# EAGLE design ESP32_Sparrow (EAGLE 9.6.2)
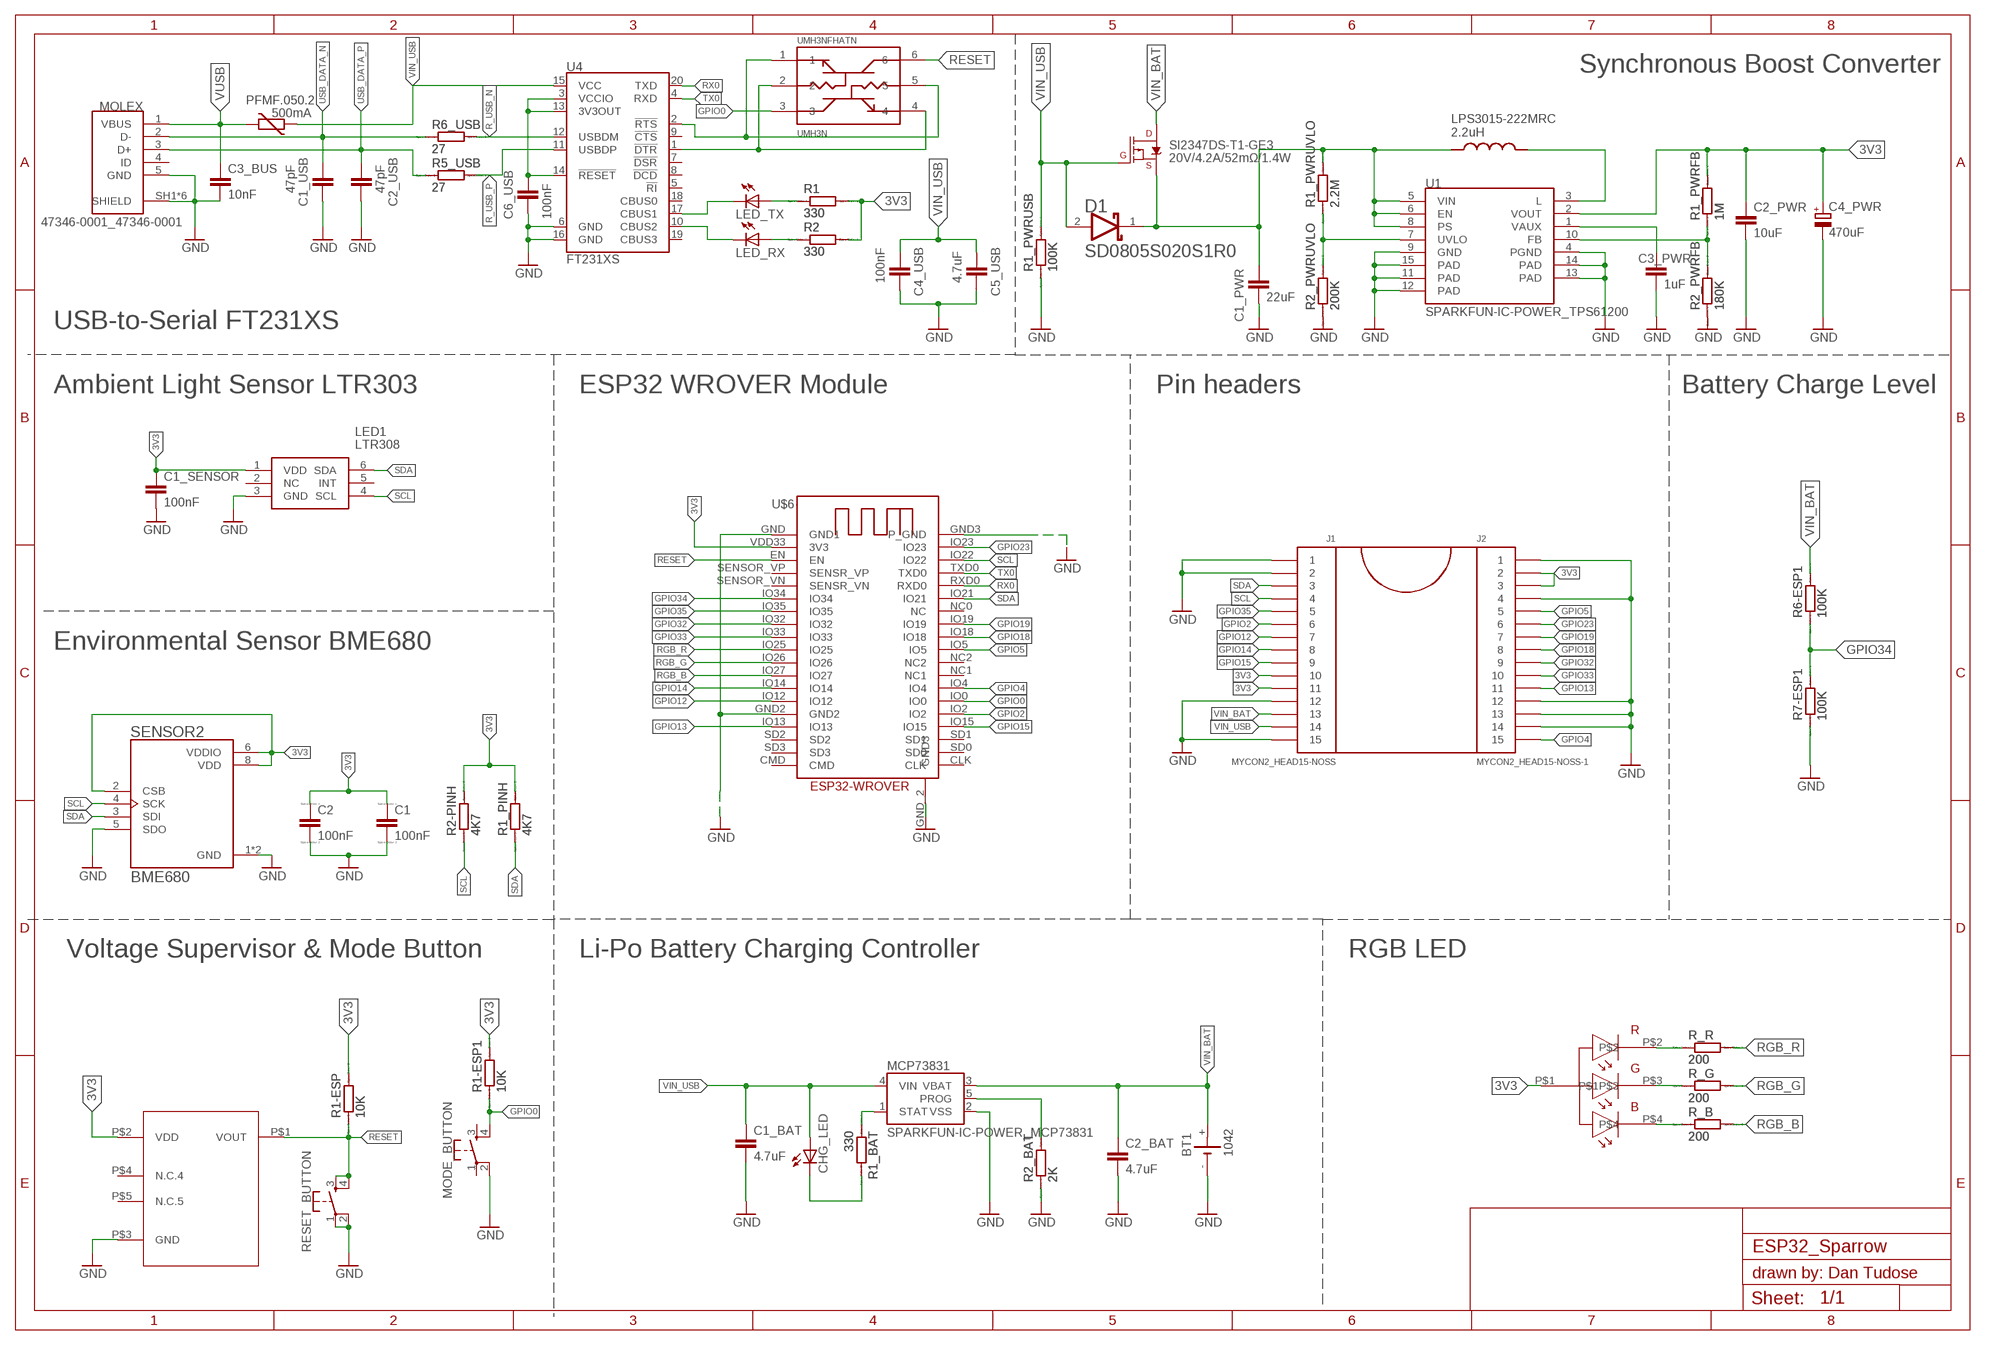
[diagram p0: schematic, sheet 1]

## Parts
BD48E27G-TR  BD48E27G-TR_BD48E27G-TR  [BD48E27G-TR_SSOP5]
BT1  1042  [BAT_1042]
C1  100nF  EAGLE-LTSPICE_CC0402  [EAGLE-LTSPICE_C0402]
C1_BAT  4.7uF  RCL_C-EUC0603  [RCL_C0603]
C1_PWR  22uF  RCL_C-EUC0603  [RCL_C0603]
C1_SENSOR  100nF  RCL_C-EUC0603  [RCL_C0603]
C1_USB  47pF  RCL_C-EUC0603  [RCL_C0603]
C2  100nF  EAGLE-LTSPICE_CC0402  [EAGLE-LTSPICE_C0402]
C2_BAT  4.7uF  RCL_C-EUC0603  [RCL_C0603]
C2_PWR  10uF  RCL_C-EUC0603  [RCL_C0603]
C2_USB  47pF  RCL_C-EUC0603  [RCL_C0603]
C3_BUS  10nF  RCL_C-EUC0603  [RCL_C0603]
C3_PWR  1uF  RCL_C-EUC0603  [RCL_C0603]
C4_PWR  470uF  RCL_CPOL-EUD/7343-31R  [RCL_D/7343-31R]
C4_USB  100nF  RCL_C-EUC0603  [RCL_C0603]
C5_USB  4.7uF  RCL_C-EUC0603  [RCL_C0603]
C6_USB  100nF  RCL_C-EUC0603  [RCL_C0603]
CHG_LED  ADAFRUIT_LEDCHIP-LED0603  [ADAFRUIT_CHIP-LED0603]
D1  AVX---SD0805S020S1R0_AVX_SD0805S020S1R0AVX_SD0805S020S1R0_0_0  [AVX---SD0805S020S1R0_AVX_SD0805S020S1R0_0]
J1  MYCON2_HEAD15-NOSS  [MYCON2_HEAD15-NOSS]
J2  MYCON2_HEAD15-NOSS-1  [MYCON2_HEAD15-NOSS-1]
LED1  LTR308  SAMACSYS_PARTS_LTR-303ALS-01  [SAMACSYS_PARTS_LTR303ALS01]
LED_RX  ADAFRUIT_LEDCHIP-LED0603  [ADAFRUIT_CHIP-LED0603]
LED_TX  ADAFRUIT_LEDCHIP-LED0603  [ADAFRUIT_CHIP-LED0603]
MCP73831  SPARKFUN-IC-POWER_MCP73831  [SPARKFUN-IC-POWER_SOT23-5]
MODE_BUTTON  SPARKFUN-SWITCHES_MOMENTARY-SWITCH-SPST-2-SMD-4.6X2.8MM  [SPARKFUN-SWITCHES_TACTILE_SWITCH_SMD_4.6X2.8MM]
MOLEX  47346-0001_47346-0001  [47346-0001_MOLEX_47346-0001]
PFMF.050.2  500mA  VARISTOR_VARISTORCN1812  [VARISTOR_CT/CN1812]
R1  330  EAGLE-LTSPICE_RR0402  [EAGLE-LTSPICE_R0402]
R1-ESP  10K  EAGLE-LTSPICE_RR0402  [EAGLE-LTSPICE_R0402]
R1-ESP1  10K  EAGLE-LTSPICE_RR0402  [EAGLE-LTSPICE_R0402]
R1_BAT  330  EAGLE-LTSPICE_RR0402  [EAGLE-LTSPICE_R0402]
R1_PINH  4K7  EAGLE-LTSPICE_RR0402  [EAGLE-LTSPICE_R0402]
R1_PWRFB  1M  EAGLE-LTSPICE_RR0402  [EAGLE-LTSPICE_R0402]
R1_PWRUSB  100K  EAGLE-LTSPICE_RR0402  [EAGLE-LTSPICE_R0402]
R1_PWRUVLO  2.2M  EAGLE-LTSPICE_RR0402  [EAGLE-LTSPICE_R0402]
R2  330  EAGLE-LTSPICE_RR0402  [EAGLE-LTSPICE_R0402]
R2-PINH  4K7  EAGLE-LTSPICE_RR0402  [EAGLE-LTSPICE_R0402]
R2_BAT  2K  EAGLE-LTSPICE_RR0402  [EAGLE-LTSPICE_R0402]
R2_PWRFB  180K  EAGLE-LTSPICE_RR0402  [EAGLE-LTSPICE_R0402]
R2_PWRUVLO  200K  EAGLE-LTSPICE_RR0402  [EAGLE-LTSPICE_R0402]
R5_USB  27  EAGLE-LTSPICE_RR0402  [EAGLE-LTSPICE_R0402]
R6-ESP1  100K  EAGLE-LTSPICE_RR0402  [EAGLE-LTSPICE_R0402]
R6_USB  27  EAGLE-LTSPICE_RR0402  [EAGLE-LTSPICE_R0402]
R7-ESP1  100K  EAGLE-LTSPICE_RR0402  [EAGLE-LTSPICE_R0402]
R_B  200  EAGLE-LTSPICE_RR0402  [EAGLE-LTSPICE_R0402]
R_G  200  EAGLE-LTSPICE_RR0402  [EAGLE-LTSPICE_R0402]
R_R  200  EAGLE-LTSPICE_RR0402  [EAGLE-LTSPICE_R0402]
RESET_BUTTON  SPARKFUN-SWITCHES_MOMENTARY-SWITCH-SPST-2-SMD-4.6X2.8MM  [SPARKFUN-SWITCHES_TACTILE_SWITCH_SMD_4.6X2.8MM]
SENSOR2  BME680  BME680_BME680  [BME680_PSON80P300X300X100-8N]
SI2347DS-T1-GE3  20V/4.2A/52mΩ/1.4W  SPARKFUN-DISCRETESEMI_MOSFET_PCH-DMG2305UX-7  [SPARKFUN-DISCRETESEMI_SOT23-3]
U1  SPARKFUN-IC-POWER_TPS61200  [SPARKFUN-IC-POWER_QFN-10_PAD]
U4  FT231XS  SPARKFUN-IC-COMMS_FT231XS  [SPARKFUN-IC-COMMS_SSOP20_L]
U$2  150202M153130_150202M153130-RGB  [150202M153130_150202M153130]
U$5  LPS3015_LPS3015  [LPS3015_LPS3015-222MRC]
U$6  ESP32-WROVER_ESP32-WROVER  [ESP32-WROVER_ESP32-WROVER]
UMH3NFHATN  UMH3N_UMH3N  [UMH3N_SOP65P210X100-6N]

## Nets
3V3: BD48E27G-TR.P$2(VDD) C1.1 C1_SENSOR.1 C2.1 C2_PWR.1 C4_PWR.+ J1.10 J1.11 J2.2 J2.3 LED1.1(VDD) R1-ESP1.2 R1-ESP.2 R1.2 R1_PINH.2 R1_PWRFB.2 R2-PINH.2 R2.2 SENSOR2.2(CSB) SENSOR2.6(VDDIO) SENSOR2.8(VDD) U1.2(VOUT) U$2.P$1 U$6.VDD33(3V3)
GND: BD48E27G-TR.P$3(GND) BT1.- C1.2 C1_BAT.2 C1_PWR.2 C1_SENSOR.2 C1_USB.2 C2.2 C2_BAT.2 C2_PWR.2 C2_USB.2 C3_BUS.2 C3_PWR.2 C4_PWR.- C4_USB.2 C5_USB.2 C6_USB.2 J1.1 J1.2 J1.12 J1.15 J2.1 J2.4 J2.12 J2.13 J2.14 LED1.3(GND) MCP73831.2(VSS) MODE_BUTTON.2 MOLEX.5(GND) MOLEX.SH1(SHIELD) MOLEX.SH2(SHIELD) MOLEX.SH3(SHIELD) MOLEX.SH4(SHIELD) MOLEX.SH5(SHIELD) MOLEX.SH6(SHIELD) R1_PWRUSB.1 R2_BAT.1 R2_PWRFB.1 R2_PWRUVLO.1 R7-ESP1.1 RESET_BUTTON.1 RESET_BUTTON.2 SENSOR2.1(GND) SENSOR2.5(SDO) SENSOR2.7(GND) U1.4(PGND) U1.9(GND) U1.11(PAD) U1.12(PAD) U1.13(PAD) U1.14(PAD) U1.15(PAD) U4.6(GND) U4.16(GND) U$6.GND2 U$6.GND3(P_GND) U$6.GND(GND1) U$6.GND_2(GND3)
GPIO0: MODE_BUTTON.4 R1-ESP1.1 U$6.IO0 UMH3NFHATN.3
GPIO2: J1.6 U$6.IO2
GPIO4: J2.15 U$6.IO4
GPIO5: J2.5 U$6.IO5
GPIO12: J1.7 U$6.IO12
GPIO13: J2.11 U$6.IO13
GPIO14: J1.8 U$6.IO14
GPIO15: J1.9 U$6.IO15
GPIO18: J2.8 U$6.IO18
GPIO19: J2.7 U$6.IO19
GPIO23: J2.6 U$6.IO23
GPIO32: J2.9 U$6.IO32
GPIO33: J2.10 U$6.IO33
GPIO34: R6-ESP1.1 R7-ESP1.2 U$6.IO34
GPIO35: J1.5 U$6.IO35
N$1: R1_PWRUVLO.1 R2_PWRUVLO.2 U1.7(UVLO)
N$5: MCP73831.1(STAT) R1_BAT.1
N$6: CHG_LED.C R1_BAT.2
N$7: MCP73831.5(PROG) R2_BAT.2
N$8: R_R.1 U$2.P$2
N$9: U1.3(L) U$5.P$2
N$10: R_G.1 U$2.P$3
N$11: R_B.1 U$2.P$4
N$12: R1_PWRFB.1 R2_PWRFB.2 U1.10(FB)
N$13: C3_PWR.1 U1.1(VAUX)
N$15: C6_USB.1 U4.3(VCCIO) U4.13(3V3OUT) U4.14(!RESET)
N$17: LED_TX.A R1.1
N$18: LED_RX.A R2.1
N$20: U4.1(!DTR) UMH3NFHATN.2 UMH3NFHATN.4
N$21: LED_TX.C U4.17(CBUS1)
N$23: LED_RX.C U4.10(CBUS2)
N$24: U4.2(!RTS) UMH3NFHATN.1 UMH3NFHATN.5
R_USB_N: R6_USB.2 U4.12(USBDM)
R_USB_P: R5_USB.2 U4.11(USBDP)
RESET: BD48E27G-TR.P$1(VOUT) R1-ESP.1 RESET_BUTTON.3 RESET_BUTTON.4 U$6.EN UMH3NFHATN.6
RGB_B: R_B.2 U$6.IO27
RGB_G: R_G.2 U$6.IO26
RGB_R: R_R.2 U$6.IO25
RX0: U4.20(TXD) U$6.RXD0
SCL: J1.4 LED1.4(SCL) R2-PINH.1 SENSOR2.4(SCK) U$6.IO22
SDA: J1.3 LED1.6(SDA) R1_PINH.1 SENSOR2.3(SDI) U$6.IO21
TX0: U4.4(RXD) U$6.TXD0
USB_DATA_N [RES_DIFF]: C1_USB.1 MOLEX.2(D-) R6_USB.1
USB_DATA_P [RES_DIFF]: C2_USB.1 MOLEX.3(D+) R5_USB.1
VIN: C1_PWR.1 D1.1(CATHODE) R1_PWRUVLO.2 SI2347DS-T1-GE3.2(S) U1.5(VIN) U1.6(EN) U1.8(PS) U$5.P$1
VIN_BAT: BT1.+ C2_BAT.1 J1.13 MCP73831.3(VBAT) R6-ESP1.2 SI2347DS-T1-GE3.3(D)
VIN_USB: C1_BAT.1 C4_USB.1 C5_USB.1 CHG_LED.A D1.2(ANODE) J1.14 MCP73831.4(VIN) PFMF.050.2.1 R1_PWRUSB.2 SI2347DS-T1-GE3.1(G) U4.15(VCC)
VUSB: C3_BUS.1 MOLEX.1(VBUS) PFMF.050.2.2
Unconnected: BD48E27G-TR.P$4(N.C.4) BD48E27G-TR.P$5(N.C.5) LED1.2(NC) LED1.5(INT) MODE_BUTTON.1 MODE_BUTTON.3 MOLEX.4(ID) U4.5(!RI) U4.7(!DSR) U4.8(!DCD) U4.9(!CTS) U4.18(CBUS0) U4.19(CBUS3) U$6.CLK U$6.CMD U$6.NC0(NC) U$6.NC1 U$6.NC2 U$6.SD0 U$6.SD1 U$6.SD2 U$6.SD3 U$6.SENSOR_VN(SENSR_VN) U$6.SENSOR_VP(SENSR_VP)

## Notes on the sheet
- Synchronous Boost Converter
- USB-to-Serial FT231XS
- Ambient Light Sensor LTR303 | ESP32 WROVER Module | Pin headers | Battery Charge Level
- Environmental Sensor BME680
- Voltage Supervisor & Mode Button | Li-Po Battery Charging Controller | RGB LED
- drawn by: Dan Tudose

## Library data of the parts
BD48E27G-TR = ESP32_WROVER:BD48E27G-TR_BD48E27G-TR
BT1 = 1042:1042: Lithium-Ion Battery Holder, 1 Cell, Plastic UL 94V-O, SMT Check availability <https://pricing.snapeda.com/parts/1042/Keystone%20Electronics%20Corp./view-part?ref=eda>; AVAILABILITY: In Stock; DESCRIPTION: SMT Holder for 18650 Battery; MF: Keystone Electronics Corp.; MP: 1042; PACKAGE: None; PRICE: None; PURCHASE-URL: https://pricing.snapeda.com/search/part/1042/?ref=eda
C1 C2 = ESP32_WROVER:EAGLE-LTSPICE_C: CAPACITOR, European symbol; SPICEMODEL: NONE; SPICEPREFIX: C
C1_BAT C1_PWR C1_SENSOR C1_USB C2_BAT C2_PWR C2_USB C3_BUS C3_PWR C4_USB C5_USB C6_USB = ESP32_WROVER:RCL_C-EU: CAPACITOR, European symbol; SPICEPREFIX: C
C4_PWR = ESP32_WROVER:RCL_CPOL-EU: POLARIZED CAPACITOR, European symbol; SPICEPREFIX: C
CHG_LED LED_RX LED_TX = ESP32_WROVER:ADAFRUIT_LED: LED OSRAM: - CHIPLED LG R971, LG N971, LY N971, LG Q971, LY Q971, LO R971, LY R971 LH N974, LH R974 LS Q976, LO Q976, LY Q976 LO Q996 - Hyper CHIPLED LW Q18S LB Q993, LB Q99A, LB R99A - SideLED LS A670, LO A670, LY A670, LG A670, LP A670 LB A673, LV A673, LT A673, LW A673 LH A674 LY A675 LS A676, LA A676, LO A676, LY A676, LW A676 LS A679, LY A679, LG A679 - Hyper Micro SIDELED® LS Y876, LA Y876, LO Y876, LY Y876 LT Y87S - SmartLED LW L88C, LW L88S LB L89C, LB L89S, LG L890 LS L89K, LO L89K, LY L89K LS L896, LA L896, LO L896, LY L896 - TOPLED LS T670, LO T670, LY T670, LG T670, LP T670 LSG T670, LSP T670, LSY T670, LOP T670, LYG T670 LG T671, LOG T671, LSG T671 LB T673, LV T673, LT T673, LW T673 LH T674 LS T676, LA T676, LO T676, LY T676, LB T676, LH T676, LSB T676, LW T676 LB T67C, LV T67C, LT T67C, LS T67K, LO T67K, LY T67K, LW E67C LS E67B, LA E67B, LO E67B, LY E67B, LB E67C, LV E67C, LT E67C LW T67C LS T679, LY T679, LG T679 LS T770, LO T770, LY T770, LG T770, LP T770 LB T773, LV T773, LT T773, LW T773 LH T774 LS E675, LA E675, LY E675, LS T675 LS T776, LA T776, LO T776, LY T776, LB T776 LHGB T686 LT T68C, LB T68C - Hyper Mini TOPLED® LB M676 - Mini TOPLED Santana® LG M470 LS M47K, LO M47K, LY M47K Source: http://www.osram.convergy.de/
D1 = ESP32_WROVER:AVX---SD0805S020S1R0_AVX_SD0805S020S1R0: Schottky Barrier Rectifier Diode; CENTROID_NOT_SPECIFIED: No; DATASHEET: http://datasheets.avx.com/schottky.pdf; DIGIKEY_DESCRIPTION: DIODE SCHOTTKY 20V 1A 0805; DIGIKEY_PART_NUMBER: 478-7800-1-ND; LEAD_FREE: yes; MF: AVX; MOUSER_PART_NUMBER: 581-SD0805S020S1R0; MPN: SD0805S020S1R0; PACKAGE: 0805 (2012 metric); PREFIX: D; ROHS: yes; TEMPERATURE_RANGE_HIGH: +125°C; TEMPERATURE_RANGE_LOW: -55°C
J1 = ESP32_WROVER:MYCON2_HEAD15-NOSS
J2 = ESP32_WROVER:MYCON2_HEAD15-NOSS-1
LED1 = ESP32_WROVER:SAMACSYS_PARTS_LTR-303ALS-01: Ambient Light Sensors Ambient Light Photo Sensor Source: Datasheet <http://optoelectronics.liteon.com/upload/download/DS86-2013-0004/LTR-303ALS-01_DS_V1.pdf>; ARROW_PART_NUMBER: LTR-303ALS-01; ARROW_PRICE-STOCK: https://www.arrow.com/en/products/ltr-303als-01/lite-on-technology?region=nac; DESCRIPTION: Ambient Light Sensors Ambient Light Photo Sensor; HEIGHT: 0mm; MANUFACTURER_NAME: Lite-On; MANUFACTURER_PART_NUMBER: LTR-303ALS-01; MOUSER_PART_NUMBER: 859-LTR-303ALS-01; MOUSER_PRICE-STOCK: https://www.mouser.co.uk/ProductDetail/Lite-On/LTR-303ALS-01?qs=Ml%2FaxAEbwm%252Bm%252BetMkBDC8g%3D%3D
MCP73831 = ESP32_WROVER:SPARKFUN-IC-POWER_MCP73831: MCP73831T Li-Ion, Li-Pol Controller Miniature single cell, fully integrated Li-Ion, Li-polymer charge management controller Datasheet <http://ww1.microchip.com/downloads/en/DeviceDoc/20001984g.pdf> SparkFun Products: SparkFun ESP32 Thing <https://www.sparkfun.com/products/13907> SparkFun 9DoF Razor IMU M0 <https://www.sparkfun.com/products/14001>; PROD_ID: IC-09995
MODE_BUTTON RESET_BUTTON = ESP32_WROVER:SPARKFUN-SWITCHES_MOMENTARY-SWITCH-SPST-2: Momentary Switch (Pushbutton) - SPST - Two Circuits Normally-open (NO) SPST momentary switches (buttons, pushbuttons). Schematic symbol includes two switch circuits. Variants SMD-4.6MMX2.8MM - 4.60mm x 2.80mm Tactile Momentary Button Switch - Used on SparkFun SAMD21 Mini Breakout <https://www.sparkfun.com/products/13664> SMD-5.2MM - Mini Pushbutton Switch - SMD <https://www.sparkfun.com/products/8720> - Used on Arduino Pro Mini <https://www.sparkfun.com/products/11114>; PROD_ID: SWCH-14139; SF_SKU: COM-08720
MOLEX = ESP32_WROVER:47346-0001_47346-0001: CONN RCPT 5POS MICRO USB R/A SMD Check prices <https://pricing.snapeda.com/parts/47346-0001/Molex/view-part?ref=eda>; AVAILABILITY: Warning; DESCRIPTION: USB - micro B USB 2.0 Receptacle Connector 5 Position Surface Mount, Right Angle; MF: Molex; MP: 47346-0001; PACKAGE: None; PRICE: None
PFMF.050.2 = ESP32_WROVER:VARISTOR_VARISTOR: VARISTOR
R1 R1-ESP R1_BAT R1_PINH R1_PWRUSB R1_PWRUVLO R2 R2-PINH R2_PWRUVLO R5_USB R6-ESP1 R6_USB R7-ESP1 R_B R_G R_R = ESP32_WROVER:EAGLE-LTSPICE_R*?: RESISTOR, European symbol; SPICEMODEL: NONE; SPICEPREFIX: R
R1-ESP1 R1_PWRFB R2_BAT R2_PWRFB = ESP32_WROVER:EAGLE-LTSPICE_R: RESISTOR, European symbol; SPICEMODEL: NONE; SPICEPREFIX: R
SENSOR2 = ESP32_WROVER:BME680_BME680: Integrated Environmental Unit; AVAILABILITY: Unavailable; DESCRIPTION: Integrated Environmental Unit; MF: Bosch Sensortec; MP: BME680; PACKAGE: LGA-8 Bosch Tools; PRICE: None
SI2347DS-T1-GE3 = ESP32_WROVER:SPARKFUN-DISCRETESEMI_MOSFET_PCH: P-channel MOSFETs Voltage controlled devices that allow control of high current outputs. SparkFun Products: SparkFun ESP32 Thing <https://www.sparkfun.com/products/13907> SparkFun ESP8266 Thing <https://www.sparkfun.com/products/13231> SparkFun Pi Servo HAT V2 <https://www.sparkfun.com/products/15316> DMG2305UX-7 (20V/4.2A/SOT23-3); PROD_ID: TRAN-14388
U1 = ESP32_WROVER:SPARKFUN-IC-POWER_TPS61200: DC to DC Booster IC-10035; PROD_ID: IC-10035
U4 = ESP32_WROVER:SPARKFUN-IC-COMMS_FT231X: FTDI FT231X Full Speed USB to Full-handshake UART This USB2.0 Full Speed IC offers a compact bridge to full handshake UART interfaces. The device is a UART, capable of operating up to 3MBaud, with low power consumption (8mA). The FT231X includes the complete FT-X series feature set and enables USB to be added into a system design quickly and easily over a UART interface. Datasheet <http://cdn.sparkfun.com/datasheets/Components/General%20IC/DS_FT231X.pdf> SparkFun Products SparkFun RedBoard - Programmed with Arduino <https://www.sparkfun.com/products/12757> (DEV-12757) SparkFun XBee Explorer USB <https://www.sparkfun.com/products/11812> (WRL-11812) SparkFun XBee Explorer Dongle <https://www.sparkfun.com/products/11697> (WRL-11697) SparkFun Blynk Board - ESP8266 <https://www.sparkfun.com/products/13794> (WRL-13794) SparkFun ESP8266 Thing - Dev Board <https://www.sparkfun.com/products/13711> (WRL-13711) SparkFun Block for Intel® Edison - Base <https://www.sparkfun.com/products/13045> (DEV-13045) SparkFun RedStick <https://www.sparkfun.com/products/13741> (DEV-13741) SparkFun Beefy 3 - FTDI Basic Breakout <https://www.sparkfun.com/products/13746> (DEV-13746) SparkFun FT231X Breakout <https://www.sparkfun.com/products/11736> (BOB-11736); PROD_ID: IC-11524
U$2 = ESP32_WROVER:150202M153130_150202M153130-RGB
U$5 = ESP32_WROVER:LPS3015_LPS3015
U$6 = ESP32_WROVER:ESP32-WROVER_ESP32-WROVER
UMH3NFHATN = ESP32_WROVER:UMH3N_UMH3N: Dual PNP/NPN transistor for chip reset; AVAILABILITY: Unavailable; DESCRIPTION: Pre-Biased Bipolar Transistor (BJT) 2 NPN - Pre-Biased (Dual) 50V 100mA 250MHz 150mW Surface Mount UMT6; MF: Rohm; MP: UMH3N; PACKAGE: SOT-363 Rohm; PRICE: None

## Board
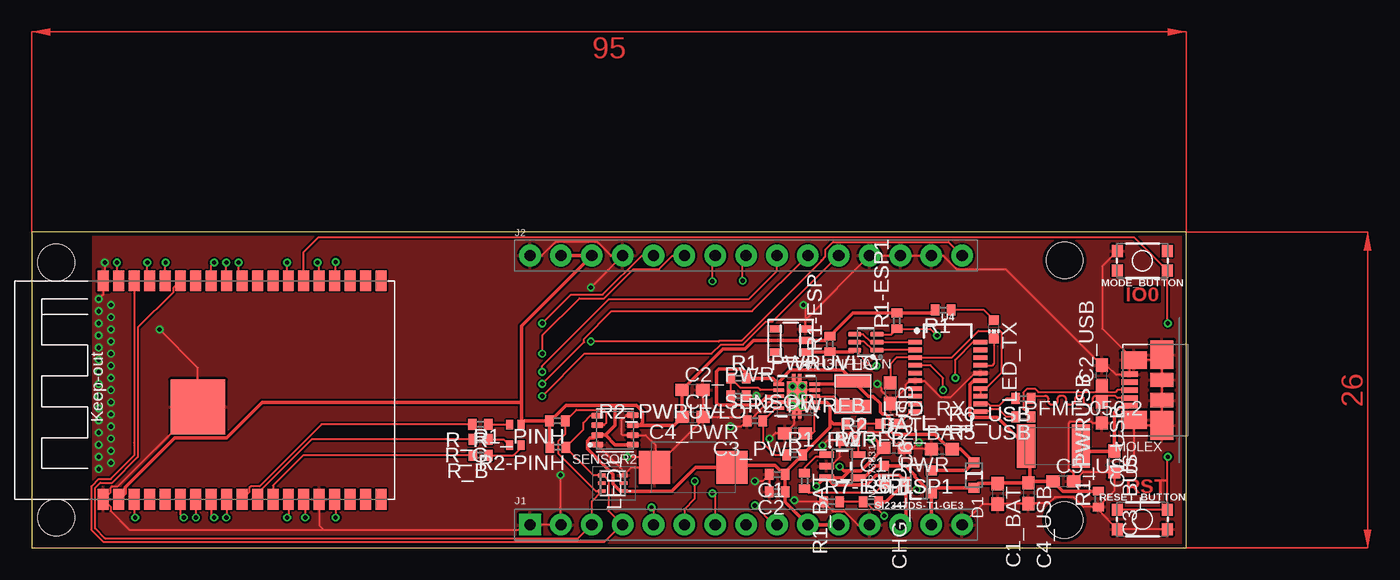
[diagram p1: board, top side]
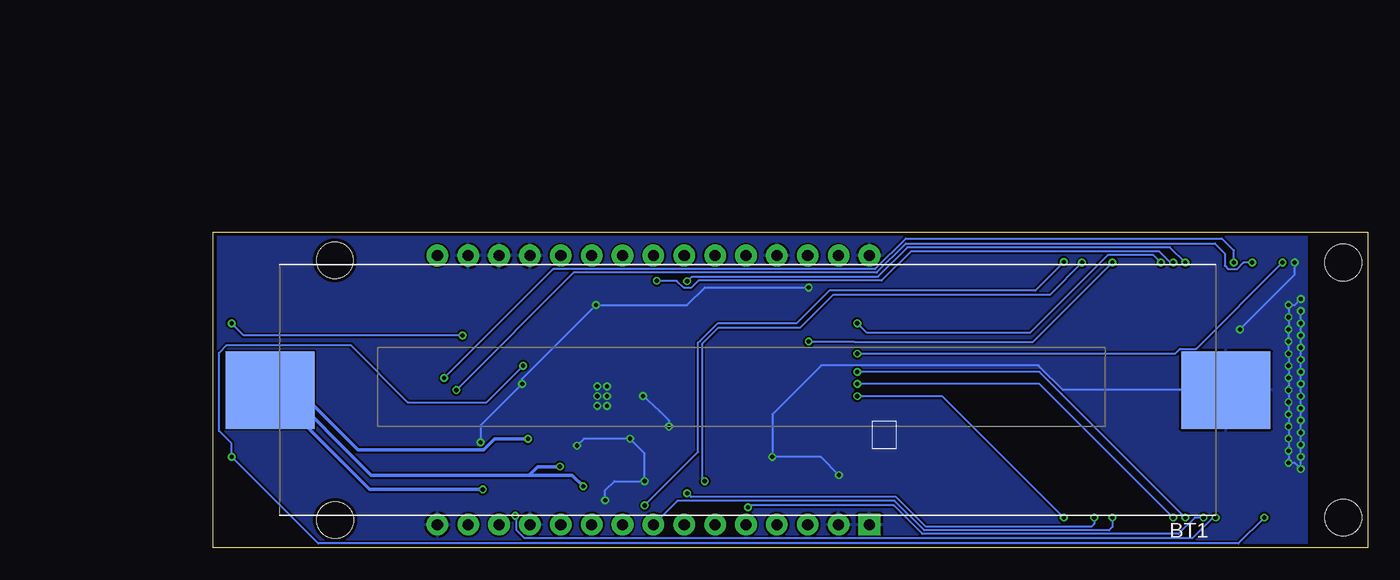
[diagram p2: board, bottom side, seen from below]

Size 95 x 26 mm. Coordinates in mm from the lower left corner, seen from the top.
Outline: 0,0 95,0 95,26 0,26 0,0
Copper layers (1*16): Top 0.035mm / dielectric 1.5mm / Bottom 0.035mm
Design rules "PCB-POOL Standard *": minimum track width 0.15mm, minimum drill 0.3mm, track to track 0.15mm, track to pad 0.15mm, pad to pad 0.15mm, via to via 0.15mm, smd to smd 0.15mm, copper to edge 0.3mm, drill to drill 0.2mm, minimum pad ring 0.2mm, minimum via ring 0.15mm, stop-mask expansion 0.03mm, vias tented up to drill 20mil, thermal gap 0.2mm
Holes 3 mm at 2,2.5 2,23.5 84.97,2.3 85,23.7

### Footprints (pad centres in the part's own frame; a part is rotated, then mirrored left to right if it is on the bottom)
BD48E27G-TR_SSOP5 = smd 0.6 x 1: P$1 -0.95,-0.8; P$2 0,-0.8; P$3 0.95,-0.8; P$4 0.95,1.6; P$5 -0.95,1.6
BAT_1042 = smd 7.35 x 6.35: + 39.33,0; - -39.33,0
EAGLE-LTSPICE_C0402 = smd 0.7 x 0.9: 1 -0.65,0; 2 0.65,0
RCL_C0603 = smd 1.1 x 1: 1 -0.85,0; 2 0.85,0
RCL_D/7343-31R = smd 2.55 x 2.7: + 3.175,0; - -3.175,0
ADAFRUIT_CHIP-LED0603 = smd 0.8 x 0.8: A 0,-0.75; C 0,0.75
AVX---SD0805S020S1R0_AVX_SD0805S020S1R0_0 = smd 0.8 x 0.9: 1 -1.05,0; 2 1.05,0
MYCON2_HEAD15-NOSS = drill 0.914 pad 1.778 square: 1 0,0 | drill 0.914 pad 1.778: 2 2.54,0; 3 5.08,0; 4 7.62,0; 5 10.16,0; 6 12.7,0; 7 15.24,0; 8 17.78,0; 9 20.32,0; 10 22.86,0; 11 25.4,0; 12 27.94,0; 13 30.48,0; 14 33.02,0; 15 35.56,0
MYCON2_HEAD15-NOSS-1 = drill 0.914 pad 1.778: 1 0,0; 2 2.54,0; 3 5.08,0; 4 7.62,0; 5 10.16,0; 6 12.7,0; 7 15.24,0; 8 17.78,0; 9 20.32,0; 10 22.86,0; 11 25.4,0; 12 27.94,0; 13 30.48,0; 14 33.02,0; 15 35.56,0
SAMACSYS_PARTS_LTR303ALS01 = smd 0.3 x 0.65: 1 -0.65,-0.9; 2 0,-0.9; 3 0.65,-0.9; 4 0.65,0.9; 5 0,0.9; 6 -0.65,0.9
SPARKFUN-IC-POWER_SOT23-5 = smd 0.55 x 1.2: 1 -0.95,-1.3; 2 0,-1.3; 3 0.95,-1.3; 4 0.95,1.3; 5 -0.95,1.3
SPARKFUN-SWITCHES_TACTILE_SWITCH_SMD_4.6X2.8MM = smd 0.9 x 1: 1 -2.05,-0.8; 2 2.05,-0.8; 3 2.05,0.8; 4 -2.05,0.8
47346-0001_MOLEX_47346-0001 = smd 0.45 x 1.38: 1 -1.3,2.66; 2 -0.65,2.66; 3 0,2.66; 4 0.65,2.66; 5 1.3,2.66 | smd 1.475 x 2.1: SH1 -2.462,2.3; SH2 2.462,2.3 | smd 2.375 x 1.9: SH3 -2.913,0; SH6 2.913,0 | smd 1.175 x 1.9: SH4 -0.838,0; SH5 0.838,0
VARISTOR_CT/CN1812 = smd 1.5 x 3.6: 1 -2.25,0; 2 2.25,0
EAGLE-LTSPICE_R0402 = smd 0.7 x 0.9: 1 -0.65,0; 2 0.65,0
BME680_PSON80P300X300X100-8N = smd 1.016 x 0.5: 1 1.458,1.2; 2 1.458,0.4; 3 1.458,-0.4; 4 1.458,-1.2; 5 -1.458,-1.22; 6 -1.458,-0.4; 7 -1.458,0.4; 8 -1.458,1.2
SPARKFUN-DISCRETESEMI_SOT23-3 = smd 0.8 x 0.9: 1 -0.95,-1; 2 0.95,-1; 3 0,1.1
SPARKFUN-IC-POWER_QFN-10_PAD = smd 0.297 x 0.85: 1 -1,-1.475; 2 -0.5,-1.475; 3 0,-1.475; 4 0.5,-1.475; 5 1,-1.475; 6 1,1.475; 7 0.5,1.475; 8 0,1.475; 9 -0.5,1.475; 10 -1,1.475 | smd 0.7 x 0.28: 11 -1.5,0.25; 12 -1.5,-0.25; 13 1.5,0.25; 14 1.5,-0.25 | smd 2.4 x 1.65: 15 0,0
SPARKFUN-IC-COMMS_SSOP20_L = smd 0.381 x 1.143: 1 -2.857,-2.68; 2 -2.223,-2.68; 3 -1.587,-2.68; 4 -0.953,-2.68; 5 -0.318,-2.68; 6 0.318,-2.68; 7 0.953,-2.68; 8 1.587,-2.68; 9 2.223,-2.68; 10 2.857,-2.68; 11 2.857,2.68; 12 2.223,2.68; 13 1.587,2.68; 14 0.953,2.68; 15 0.318,2.68; 16 -0.318,2.68; 17 -0.953,2.68; 18 -1.587,2.68; 19 -2.223,2.68; 20 -2.857,2.68
150202M153130_150202M153130 = smd 0.8 x 0.6: P$1 -0.85,0.475; P$2 -0.85,-0.475; P$3 0.85,-0.475; P$4 0.85,0.475
LPS3015_LPS3015-222MRC = smd 1.14 x 3.05: P$1 1.075,-0.025; P$2 -1.075,-0.025
ESP32-WROVER_ESP32-WROVER = smd 1.7 x 0.9: CLK 18,1.27; CMD 0,1.27; EN 0,21.59; GND 0,24.13; GND3 18,24.13; GND_2 0,6.35; IO0 18,7.62; IO2 18,6.35; IO4 18,8.89; IO5 18,12.7; IO12 0,7.62; IO13 0,5.08; IO14 0,8.89; IO15 18,5.08; IO18 18,13.97; IO19 18,15.24; IO21 18,17.78; IO22 18,21.59; IO23 18,22.86; IO25 0,12.7; IO26 0,11.43; IO27 0,10.16; IO32 0,15.24; IO33 0,13.97; IO34 0,17.78; IO35 0,16.51; NC0 18,16.51; NC1 18,10.16; NC2 18,11.43; RXD0 18,19.05; SD0 18,2.54; SD1 18,3.81; SD2 0,3.81; SD3 0,2.54; SENSOR_VN 0,19.05; SENSOR_VP 0,20.32; TXD0 18,20.32; VDD33 0,22.86 | smd 4.5 x 4.5: GND2 7.62,16.34
UMH3N_SOP65P210X100-6N = smd 1.09 x 0.4: 1 -0.92,0.65; 2 -0.92,0; 3 -0.92,-0.65; 4 0.92,-0.65; 5 0.92,0; 6 0.92,0.65

### Placement (x,y rotation side)
BD48E27G-TR  62.85,17.08 90 top
BT1  51,13 180 bottom
C1  61.34,6.04 180 top
C1_BAT  79.49,4.46 270 top
C1_PWR  74.88,8.14 180 top
C1_SENSOR  54.38,10.78 0 top
C1_USB  88.05,11.15 270 top
C2  61.34,4.63 180 top
C2_BAT  70.97,8.24 0 top
C2_PWR  54.35,13.02 0 top
C2_USB  88.05,14.2 90 top
C3_BUS  89.09,7.12 270 top
C3_PWR  62.81,9.44 180 top
C4_PWR  54.43,6.63 0 top
C4_USB  82.02,4.51 270 top
C5_USB  84.9,5.49 0 top
C6_USB  70.64,12.74 270 top
CHG_LED  70.12,6.01 180 top
D1  77.53,6 270 top
J1  41,1.92 0 top
J2  41,24.08 0 top
LED1  47.8,5.33 90 top
LED_RX  70.59,10.22 270 top
LED_TX  79.18,18.01 180 top
MCP73831  66.7,6.73 270 top
MODE_BUTTON  91.4,23.65 180 top
MOLEX  93,13 90 top
PFMF.050.2  84.08,8.38 0 top
R1  75.01,19.58 180 top
R1-ESP  65.68,16.8 90 top
R1-ESP1  71.19,18.7 90 top
R1_BAT  63.59,5.52 270 top
R1_PINH  43.25,10.47 180 top
R1_PWRFB  62.79,7.68 0 top
R1_PWRUSB  87.77,4.02 90 top
R1_PWRUVLO  58.16,13.98 0 top
R2  67.63,10.23 180 top
R2-PINH  43.27,8.29 180 top
R2_BAT  67.17,8.85 0 top
R2_PWRFB  59.51,10.48 0 top
R2_PWRUVLO  58.16,12.52 180 top
R5_USB  81.6,10.8 180 top
R6-ESP1  69.06,3.81 0 top
R6_USB  81.6,12.3 180 top
R7-ESP1  65.82,3.81 0 top
R_B  36.93,7.63 180 top
R_G  36.92,8.93 180 top
R_R  36.9,10.18 180 top
RESET_BUTTON  91.4,2.35 0 top
SENSOR2  47.99,9.7 180 top
SI2347DS-T1-GE3  73.02,5.45 90 top
U1  62.95,12.5 90 top
U4  75.38,14.09 270 top
U$2  39.78,9.31 270 top
U$5  67.55,12.7 90 top
U$6  30,4 90 top
UMH3NFHATN  68.64,16.95 180 top

### Tracks (layer width: path | path; a pad name or v marks a point on that pad's centre or on a via)
3V3
  Top 0.3: J1.11 J1.10 | U1.2 65.43,12 65.7,11.72 65.7,10.5 | R1_PWRFB.2 65.7,9.94 65.7,10.5 | R2.2 65.97,10.23 65.7,10.5
  Top 0.305: J2.2 J2.3 40.3,18.3 40.3,12 | R1.2 74.13,19.35 R1-ESP1.2 67.58,19.35 R1-ESP.2 65.31,17.08 BD48E27G-TR.P$2 59.4,17.08 58.7,16.38 56.86,16.38 C2_PWR.1 53.5,10.81 C1_SENSOR.1 52.85,10.1 50,10.1 | R1_PWRFB.2 61.99,6.23 C1.1 | C1.1 61.91,6.04 61.16,6.8 57.77,6.8 C4_PWR.+ 54.6,6.63 52.66,4.68 LED1.1 48.45,4.68 47.83,5.3 47.83,6.05 45.72,8.16 45.72,8.84 45.94,9.05 46.28,9.05 SENSOR2.2 47.2,9.3 | C1.1 C2.1 61.99,3.79 J1.10 | SENSOR2.8 48,8.5 47.2,9.3 | R1_PINH.2 42.6,8.31 R2-PINH.2 | R1_PINH.2 42.67,10.47 43.95,11.75 48,11.75 | 48,11.75 49.77,11.75 50.26,11.26 50.26,10.36 50,10.1 | R1_PINH.2 40.56,10.47 40.3,10.2 | 40.3,10.2 U$2.P$1 | U$6.VDD33 7.66,4.52 7.66,4.97 11.75,9.07 16.04,9.07 18.97,12 40.3,12 | 40.3,12 40.3,10.2 | 50,10.1 SENSOR2.6 | 48,11.75 48,10.1 47.2,9.3
GND  (via drill 0.35)
  Top 0.15: U1.11 62.7,10.18 62.01,9.49 C3_PWR.2 | 63.2,11.3 62.5,12 U1.9 | MCP73831.2 65.73,6.73 66.52,7.52 R2_BAT.1 | R7-ESP1.1 65.95,3.03 66.86,3.03 67.97,1.92 J1.12 | C1_PWR.2 72.44,8.14 71.92,8.14 C2_BAT.2 | J1.15 78.25,3.61 C1_BAT.2 79.54,3.66 C4_USB.2 83.68,3.66 84.19,4.17 85.75,4.17 86.55,3.37 R1_PWRUSB.1 | C5_USB.2 86.53,6.27 C3_BUS.2 89.09,6 89.09,4.69 R1_PWRUSB.1 | R1_PWRUSB.1 87.77,3.13 RESET_BUTTON.1 RESET_BUTTON.2 | 91.15,10.09 MOLEX.SH3 MOLEX.SH4 MOLEX.SH5 MOLEX.SH6 92.55,15.46 MOLEX.SH2 90.34,15.1 MOLEX.5 89.2,14.3 88.45,15.05 C2_USB.2 | 63.24,3.81 62.86,3.81 v62.75,3.92
  Top 0.152: 91.15,10.09 MOLEX.SH1 90.7,7.61 89.09,6 | C2.2 C1.2 60.14,5.5 v59.5,5.5 | U1.11 U1.12 63.2,11.3 62.95,11.55 U1.15 62.95,12.95 63.2,13.2 | U4.16 78.04,14.38 77.59,14.38 75.65,12.45 74.77,12.45 73.45,13.77 U4.6 72.68,13.75 72.23,13.75 71.9,13.42 71.9,13.15 C6_USB.2 70.47,11.72 70.47,12.39 69.91,12.95 69.91,13.16 v69.58,13.5 | U1.13 U1.14 63.2,13.2 | U1.4 63.4,13 63.2,13.2 | BD48E27G-TR.P$3 63.65,18.79 | 63.65,18.79 J2.12 J2.13 J2.14 74.98,24.08 76.1,22.96 80.14,22.96 C2_USB.2 | U$6.GND_2 23.65,1.85 24,1.5 | 24,1.5 40.08,1.5 40.5,1.92 J1.1 J1.2 43.5,1.96 v43.5,6 | 24,1.5 8.02,1.5 6.46,3.06 6.46,3.41 U$6.GND 6.46,4.59 6.46,4.94 6.6,5.08 7.08,5.08 13.14,11.14 13.14,11.62 U$6.GND2 13.66,14.84 v10.5,18 | SENSOR2.5 48.92,10.92 48.5,10.5 48.5,9.41 48.58,9.32 49.42,9.32 SENSOR2.7 49.47,9.28 50.51,9.28 51.31,8.48 51.31,6.69 | C2_PWR.2 55.23,12.99 C1_SENSOR.2 | C1_SENSOR.2 58.56,10.78 R2_PWRFB.1 | J2.1 41.96,24.08 43.08,25.2 46.54,25.2 47.66,24.08 J2.4 v46,21.45 | U1.9 61.45,11.97 60.53,11.97 59.04,10.48 R2_PWRFB.1 | R2_PWRUVLO.1 59.62,12.49 v59.64,12.51 | v57.5,10 58.38,10 R2_PWRFB.1 | v60.71,9 61.2,9.49 62.01,9.49 | C2_BAT.2 71.49,8.24 70.2,9.53 67.38,9.53 66.7,8.85 R2_BAT.1 65.49,8.85 v65.07,8.43 | MOLEX.SH2 88.1,18.06 88.1,23.2 MODE_BUTTON.2 | C4_PWR.- 49.35,6.63 LED1.3 48.7,6.33 SENSOR2.1 | C1_SENSOR.2 55.23,10.61 51.31,6.69 | 51.31,6.69 C4_PWR.- | v6,23.5 6,22.13 U$6.GND3 5.87,20.87 v5.5,20.5 | v49,7.5 50.38,7.5 C4_PWR.- | v63.5,20 63.65,19.85 63.65,18.79 | R7-ESP1.1 63.24,3.81 | C5_USB.2 85.75,6.09 85.35,6.49 85.35,10.27 85.49,10.41 87.17,10.41 87.28,10.3 C1_USB.2
  Top 0.152: v73,8.7 72.44,8.14
  Bottom 0.15: v62.75,3.92 62.75,4.75 62,5.5 v59.5,5.5 | BT1.- 25.08,13 27.04,14.96 | 45,15 49,11 v49,7.5
  Bottom 0.152: v59.64,12.51 58.28,11.28 57.5,10.5 v57.5,10 | v59.5,5.5 59.5,7.79 v60.71,9 64.5,9 v65.07,8.43 | v10.5,18 6,22.5 v6,23.5 | v43.5,6 45,7.5 v49,7.5 | v73,8.7 73,10.07 v69.58,13.5 69.58,13.93 v63.5,20 56,20 54.55,21.45 v46,21.45 | 45,15 44.95,15.05 27.13,15.05 27.04,14.96 | v5.5,20.5 6,20 v6.5,20 v6.5,19 v6.5,18 v6.5,17 v6.5,16 v6.5,15 v6.5,14 v6.5,13 v6.5,12 v6.5,11 v6.5,10 v6.5,9 v6.5,8 v6.5,7 6,7 v5.5,6.5 v5.5,7.5 v5.5,8.5 v5.5,9.5 v5.5,10.5 v5.5,11.5 v5.5,12.5 v5.5,13.5 v5.5,14.5 v5.5,15.5 v5.5,16.5 v5.5,17.5 v5.5,18.5 v5.5,19.5
  other vias: 62.6,13.3 63.4,13.3 62.6,12.5 63.4,12.5 62.6,11.7 63.4,11.7
  pour Top: 5,27 5,-2 95,-2 97,0 97,26 95,28 5,28
  pour Bottom: 5,29 5,-3 95,-3 98,0 98,26 95,29
GPIO0  (via drill 0.35)
  Top 0.152: UMH3NFHATN.3 70.74,17.6 R1-ESP1.1 73.95,18.05 v74.5,17.5 | v93.5,18.5 93.45,18.55 MODE_BUTTON.4 90.7,25.6 23.6,25.6 22.38,24.38 U$6.IO0
  Bottom 0.152: v74.5,17.5 92.5,17.5 v93.5,18.5
GPIO2  (via drill 0.35)
  Top 0.15: v54.55,5.5 54.55,4.05 53.7,3.2 J1.6
  Top 0.152: U$6.IO2 23.65,23.35 v23.5,23.5
  Bottom 0.15: 44,20.83 46.71,18.12 53.45,18.12 54.79,16.79
  Bottom 0.152: v23.5,23.5 26.17,20.83 44,20.83 | 54.79,16.79 54.79,5.74 v54.55,5.5
GPIO4  (via drill 0.35)
  Top 0.152: U$6.IO4 21,22.11 v21,23.5 | J2.15 75.44,25.2 65.94,25.2 65.28,24.54 65.28,24 64.97,23.69 64.97,23.62 58.42,17.06 56.58,17.06 56.52,17 v46,17
  Bottom 0.152: v46,17 42.28,17 42.23,16.95 27.55,16.95 v21,23.5
GPIO5  (via drill 0.35)
  Top 0.152: U$6.IO5 17,22.3 v17,23.5 | v42,18.5 44.36,20.86 46.98,20.86 50.2,24.08 J2.5
  Bottom 0.15: v17,23.5 17.62,24.12 21.38,24.12 27.75,17.75
  Bottom 0.152: v42,18.5 41.25,17.75 27.75,17.75
GPIO12  (via drill 0.35)
  Top 0.15: U$6.IO12 22.5,3.88 v22.5,2.5 | v56,4.5 56.24,4.26 J1.7
  Bottom 0.15: v22.5,2.5 22.5,2 22.75,1.75 36.36,1.75 38.8,4.19 55.69,4.19 v56,4.5
GPIO13  (via drill 0.35)
  Top 0.15: U$6.IO13 25,3.92 v25,2.5
  Top 0.152: J2.11 60.95,18.63 60.42,18.63 58.54,16.76 56.7,16.76 55.95,16 45.5,16 v42,12.5
  Bottom 0.152: v25,2.5 35,12.5 v42,12.5
GPIO14  (via drill 0.35)
  Top 0.15: U$6.IO14 21.11,2.61 v21,2.5
  Bottom 0.15: v21,2.5 21,1.72 21.27,1.45 36.48,1.45 38.93,3.89 56.81,3.89 J1.8
GPIO15  (via drill 0.35)
  Top 0.15: U$6.IO15 25,22.08 v25,23.55
  Top 0.152: J1.9 61.08,1.92 v59.5,3.5
  Bottom 0.15: 54.85,17.15 54.91,17.09 55.09,16.91
  Bottom 0.152: v25,23.55 27.35,21.2 44.3,21.2 47,18.5 53.5,18.5 54.85,17.15 | v59.5,3.5 55.09,7.91 55.09,16.91
GPIO18  (via drill 0.35)
  Top 0.152: U$6.IO18 16,22.03 v16,23.5 | v58.5,22 58.5,23.8 J2.8
  Bottom 0.152: v16,23.5 16.22,23.5 17.14,24.42 37.58,24.42 39.99,22.01 55.07,22.01 55.67,21.41 56.28,21.41 56.87,22 v58.5,22
GPIO19  (via drill 0.35)
  Top 0.152: U$6.IO19 14.76,23.26 v15,23.5 | v56,21.96 56,23.84 J2.7
  Bottom 0.152: v15,23.5 16.26,24.76 37.89,24.76 40.3,22.35 55.61,22.35 v56,21.96
GPIO23  (via drill 0.35)
  Top 0.152: U$6.IO23 7,22.14 v7,23.5 | J2.6 52.74,24.08 51.62,22.96 49.51,22.96 47.1,20.56 45.06,20.56 42,17.5 v42,16
  Bottom 0.152: v42,16 15.84,16 15.44,16.4 14.1,16.4 v7,23.5
GPIO32  (via drill 0.35)
  Top 0.15: U$6.IO32 14.76,2.74 v15,2.5 | 48.02,20.5 59,20.5 61.32,22.82 J2.9
  Top 0.152: v42,14.5 42,15 47.5,20.5 48.02,20.5
  Bottom 0.152: v15,2.5 25.2,12.7 27,14.5 v42,14.5
GPIO33  (via drill 0.35)
  Top 0.15: U$6.IO33 16.03,2.53 v16,2.5 | J2.10 59.28,19.5 48.05,19.5
  Top 0.152: v42,13.5 45.45,16.95 45.45,17.23 47.72,19.5 48.05,19.5
  Bottom 0.152: v16,2.5 27,13.5 v42,13.5
GPIO34  (via drill 0.35)
  Top 0.152: R7-ESP1.2 R6-ESP1.1 68.59,3.81 69.27,3.13 69.66,3.13 v70.14,2.64 | U$6.IO34 12.22,2.78 v12.5,2.5
  Bottom 0.152: v12.5,2.5 12.72,2.5 14.42,0.81 69.4,0.81 70.06,1.46 70.06,2.38 70,2.44 70,2.5 v70.14,2.64
GPIO35  (via drill 0.35)
  Top 0.15: U$6.IO35 v13.49,2.51 v13.5,2.5 | v51,3.34 51.16,3.18 J1.5
  Bottom 0.15: v13.5,2.5 14.22,2.5 15.57,1.15 36.65,1.15 39,3.5 50.84,3.5 v51,3.34
N$1
  Top 0.152: U1.7 59.95,13 59.75,13.2 58.31,13.2 57.53,13.98 R1_PWRUVLO.1 R2_PWRUVLO.2
N$5
  Top 0.152: MCP73831.1 65.22,7.5 64.5,7.5 63.59,6.59 R1_BAT.1
N$6
  Top 0.152: R1_BAT.2 63.94,4.52 69.38,4.52 CHG_LED.C
N$7
  Top 0.152: R2_BAT.2 68,8.67 MCP73831.5
N$8
  Top 0.15: R_R.1 39.28,10.18
  Top 0.152: 39.28,10.18 U$2.P$2
N$9
  Top 0.15: U$5.P$2 66.88,11.62 66.5,12
  Top 0.152: U1.3 66,12.5 66.5,12
N$10
  Top 0.15: R_G.1 38.84,8.93 U$2.P$3
N$11
  Top 0.15: R_B.1 39.63,7.63 40.26,8.26
  Top 0.152: 40.26,8.26 U$2.P$4
N$12
  Top 0.152: U1.10 61.18,11.5 R2_PWRFB.2 60.16,8.66 61.14,7.68 R1_PWRFB.1
N$13
  Top 0.152: C3_PWR.1 64.26,9.44 64.42,9.61 U1.1
N$15
  Top 0.152: U4.14 78.06,13 | 78.06,13 U4.13 | C6_USB.1 70.64,15.14 71.17,15.67 U4.3 75.71,15.67 77.92,17.89 79.67,17.89 79.81,17.75 79.81,14.43 78.53,13.15 78.21,13.15 78.06,13
N$17
  Top 0.15: LED_TX.A 78.36,19.58 R1.1
N$18
  Top 0.152: LED_RX.A R2.1
N$20
  Top 0.152: U4.1 UMH3NFHATN.2 69.05,16.95 68.4,17.6 UMH3NFHATN.4
N$21
  Top 0.15: LED_TX.C 79.18,15.18 79,15 78.1,15 U4.17
N$23
  Top 0.152: LED_RX.C 72.35,11.23 U4.10
N$24
  Top 0.152: U4.2 UMH3NFHATN.1 69.2,16.3 68.5,17 67.77,17 UMH3NFHATN.5
R_USB_N
  Top 0.152: R6_USB.2 80.19,12.3 79.6,11.7 78.9,11.7 78.74,11.86 U4.12
R_USB_P
  Top 0.152: R5_USB.2 80.19,10.8 79.6,11.4 78.9,11.4 78.73,11.23 U4.11
RESET  (via drill 0.35)
  Top 0.15: RESET_BUTTON.4 RESET_BUTTON.3 93.45,7.45 v93.5,7.5 | v69.5,15 69.02,15 UMH3NFHATN.6 | U$6.EN 8.41,2.59 v8.5,2.5
  Top 0.305: BD48E27G-TR.P$1 63.67,16.15 R1-ESP.1 67.57,16.15 UMH3NFHATN.6
  Bottom 0.15: v8.5,2.5 10.62,0.38 86.38,0.38 v93.5,7.5 93.5,8.6 94.53,9.63 94.53,16.07 93.9,16.7 83.7,16.7 79,12 72.5,12 v69.5,15
RGB_B
  Top 0.15: R_B.2 22.33,7.63
  Top 0.152: 22.33,7.63 19.84,5.14 U$6.IO27
RGB_G
  Top 0.15: R_G.2 23.01,8.93 18.57,4.49 U$6.IO26
RGB_R
  Top 0.15: R_R.2 23.83,10.18 18.73,5.08 18.03,5.08 17.89,4.94 17.89,4.59 U$6.IO25
RX0  (via drill 0.35)
  Top 0.152: U$6.RXD0 10.95,23.45 v11,23.5 | v76,14 76,15.5 77.5,17 78,17 U4.20
  Bottom 0.152: v11,23.5 11,24.5 12,25.5 38,25.5 40.54,22.96 67.03,22.96 v76,14
SCL
  Top 0.15: 47.04,5.98 LED1.4 | 48.62,2 48.56,1.94 47.12,0.5 5.87,0.5 4.89,1.49 4.89,5.07 4.91,5.09 | U$6.IO22 8.41,8.67
  Top 0.152: LED1.4 46.23,5.98 R2-PINH.1 45.4,9.77 45.4,10.31 45.99,10.9 SENSOR2.4 | J1.4 48.62,2 | 47.04,5.98 47.05,5.98 47.45,5.57 47.45,3.05 48.56,1.94 | 4.91,5.09 5.5,5.68 6.48,5.68 8.41,7.61 8.41,8.67
SDA
  Top 0.15: R1_PINH.1 44.8,11.38 47.1,11.38 47.27,11.21 47.27,10.29 47.1,10.12 46.56,10.12 SENSOR2.3 | U$6.IO21 11.62,21.41 11.62,21.06 8.72,18.15 8.72,7.49 | 5.19,1.61 6,0.8 44.96,0.8 J1.3
  Top 0.152: R1_PINH.1 43.9,9.39 43.34,8.83 43.34,7.75 46.44,4.65 46.87,4.65 LED1.6 46.08,3.86 J1.3 | 8.72,7.49 6.61,5.38 5.63,5.38 5.19,4.94 5.19,1.61
TX0  (via drill 0.35)
  Top 0.152: U$6.TXD0 9.5,22.18 v9.5,23.5 | v75,13 75,14 73.96,15.04 U4.4
  Bottom 0.15: 38.01,25.07 12.57,25.07 11.75,24.25 11.75,23.25
  Bottom 0.152: v9.5,23.5 10.22,23.5 10.77,22.95 11.45,22.95 11.75,23.25 | 38.01,25.07 40.41,22.66 65.34,22.66 v75,13
USB_DATA_N
  Top 0.152: MOLEX.2 89.34,12.35 89.17,12.52 87.9,12.52 | 87.9,12.52 87.57,12.52 arc90 87.31,12.26 87.31,12.06 arc-90 87.04,11.79 86.85,11.79 arc-90 86.58,12.06 86.58,12.26 arc90 86.31,12.52 86.12,12.52 arc90 85.85,12.26 85.85,12.06 arc-90 85.58,11.79 85.39,11.79 arc-90 85.12,12.06 85.12,12.26 arc90 84.86,12.52 84.66,12.52 arc90 84.39,12.26 84.39,12.06 arc-90 84.13,11.79 83.93,11.79 arc-90 83.67,12.06 83.67,12.26 arc90 83.4,12.52 82.1,12.52 82.1,12.45 R6_USB.1 | C1_USB.1 87.9,12.15 87.9,12.52
USB_DATA_P
  Top 0.152: MOLEX.3 89.34,13 89.17,12.83 88.05,12.83 | 88.05,12.83 82.83,12.83 82.83,12.85 82.59,13.08 81.88,13.08 81.6,12.8 81.6,11.45 R5_USB.1 | C2_USB.1 88.05,12.83
VIN
  Top 0.3: SI2347DS-T1-GE3.2 76.88,6.4 D1.1 76.44,8.14 C1_PWR.1 | U$5.P$1 67.3,13.5 U1.5 | U1.6 61.48,13.69 62.44,14.65 65.85,14.65
  Top 0.305: U1.8 60.52,12.5 59.78,11.77 56.53,11.77 56.36,11.95 56.36,14.55 56.53,14.73 58.48,14.73 58.81,14.41 R1_PWRUVLO.2 60.99,13.98 U1.6 | C1_PWR.1 75.51,8.14 74.31,9.34 70.96,9.34 70.64,9.66 70.64,10.65 70.25,11.04 70.02,11.04 69.84,11.21 69.84,11.88 69.22,12.5 68.85,12.5 U$5.P$1 66.7,14.65 65.85,14.65
VIN_BAT  (via drill 0.35)
  Top 0.3: SI2347DS-T1-GE3.3 71.92,5 71.92,2.36 J1.13 | SI2347DS-T1-GE3.3 70.28,3.81 R6-ESP1.2 | SI2347DS-T1-GE3.3 71.41,5.96 69.48,5.96 68.72,5.2 65.98,5.2 65.59,5.59 MCP73831.3
  Top 0.305: 67.28,6.36 68.24,6.36 C2_BAT.1 69.39,8.97 v69.1,8.97 | MCP73831.3 66.7,5.78 67.28,6.36 | v64.55,5.08 65.06,5.59 65.59,5.59 | v66.47,6.7 66.81,6.36 67.28,6.36 | v72.82,4.82 72.1,4.82 71.92,5
  Bottom 0.305: BT1.+ 82.15,4.82 v72.82,4.82 | v64.55,5.08 65.47,6 69,6 | v69.1,8.97 71.84,8.97 72.74,8.07 83.07,8.07 89,14 89.5,13.5 82,6 69,6 | v66.47,6.7 68.3,6.7 69,6
VIN_USB
  Top 0.152: 77.57,13.77 U4.15 | 82.13,5.47 C4_USB.1 | 79.54,5.36 C1_BAT.1
  Top 0.3: R1_PWRUSB.2 84.87,4.67 C5_USB.1 82.15,5.49 | 82.15,5.49 82.13,5.47 | 82.15,5.49 82.15,8.06 PFMF.050.2.1 79.47,10.73 77.36,10.73 77.19,10.91 77.19,13.45 77.5,13.77 77.57,13.77 | C4_USB.1 79.54,5.36 | C1_BAT.1 77.89,5.31 D1.2 74.47,4.95 SI2347DS-T1-GE3.1 J1.14 | CHG_LED.A 69.48,6.76 68.5,5.78 MCP73831.4
  Top 0.305: SI2347DS-T1-GE3.1 72.67,5.85 72.67,5.97 71.89,6.76 CHG_LED.A
VUSB
  Top 0.3: 86.74,7.97 PFMF.050.2.2
  Top 0.305: MOLEX.1 90.22,11.58 89.52,11.58 89.09,11.15 C3_BUS.1 86.74,7.97
(copper drawn outside any net)
  shapes: Top area x2

### Text on the board
Top: IO0 | RST
tStop: IO0 | RST
silk_bottom: 5 | 23 | 19 | 18 | 32 | 33 | 13 | 4 | GND | 3V3 | 3V3 | GND | GND | GND | GND | GND | GND | SDA | SCL | 35 | 2 | 12 | 14 | 15 | 3V3 | 3V3 | GND | BAT | USB | GND